# Altium schematic sheet [5]-Motor Driver_DRV8701.SchDoc
size A4
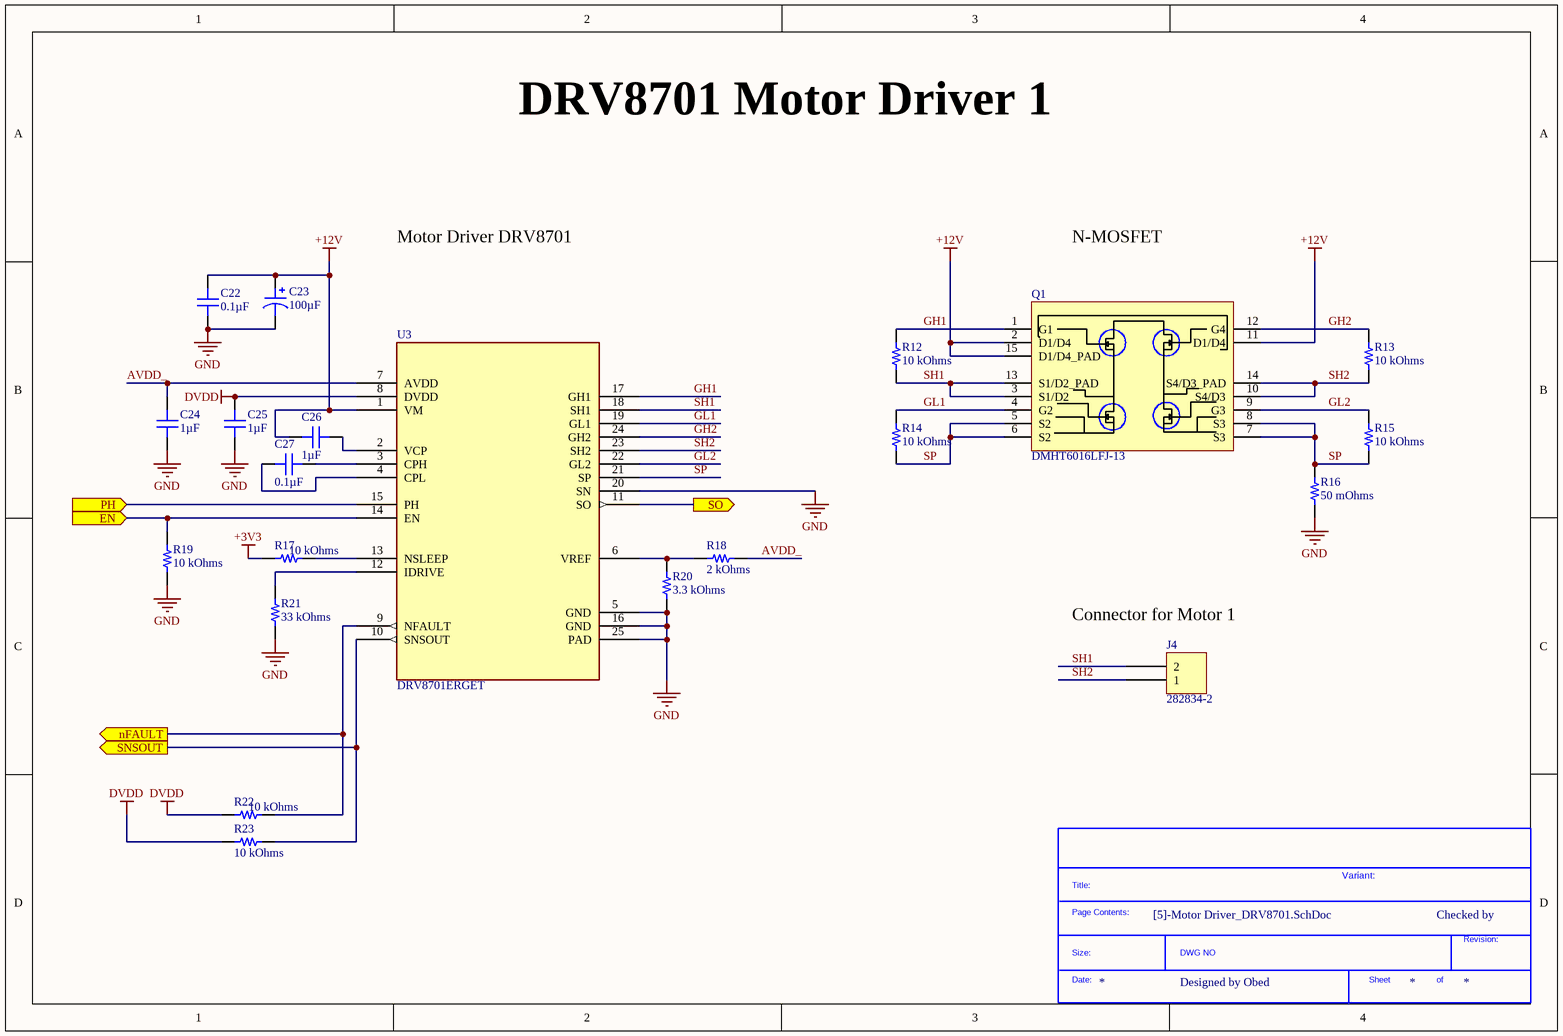
[diagram p0: [5]-Motor Driver_DRV8701.SchDoc]

## Parts
*?  SDTitleBlock  (value not drawn)  (graphical)
C22  0.1µF  [CAP 0805_2012]
C23  100µF  [CAP ALSMD 8.3MM H10.5MM]
C24  1µF  [CAP 0805_2012]
C25  1µF  [CAP 0805_2012]
C26  1µF  [CAP 0805_2012]
C27  0.1µF  [CAP 0805_2012]
J4  282834-2  [TE 282834-2]
Q1  DMHT6016LFJ-13  [DFN5045-12_33_212_27X15_SMD_1]
R12  10 kOhms  [RES 0805_2012]
R13  10 kOhms  [RES 0805_2012]
R14  10 kOhms  [RES 0805_2012]
R15  10 kOhms  [RES 0805_2012]
R16  50 mOhms  [RES 2512_6432]
R17  10 kOhms  [RES 0805_2012]
R18  2 kOhms  [RES 0603_1608]
R19  10 kOhms  [RES 0805_2012]
R20  3.3 kOhms  [RES 0603_1608]
R21  33 kOhms  [RES 0805_2012]
R22  10 kOhms  [RES 0805_2012]
R23  10 kOhms  [RES 0805_2012]
U3  DRV8701ERGET  [QFN50P400X400X100-25N]

## Ports
EN (in), nFAULT (out), PH (in), SNSOUT (out), SO (out)

## Nets
+3V3: R17.2
+12V: C22.1 C23.1 C26.2 Q1.2(D1/D4) Q1.11(D1/D4) Q1.15(D1/D4_PAD) U3.1(VM)
DVDD: C25.2 R22.2 R23.2 U3.8(DVDD)
GND: C22.2 C23.2 C24.1 C25.1 R16.1 R19.2 R20.1 R21.1 U3.5(GND) U3.16(GND) U3.20(SN) U3.25(PAD)
AVDD_: C24.2 R18.1 U3.7(AVDD)
EN: R19.1 U3.14(EN) ; port EN
GH1: Q1.1(G1) R12.2 U3.17(GH1)
GH2: Q1.12(G4) R13.2 U3.24(GH2)
GL1: Q1.4(G2) R14.2 U3.19(GL1)
GL2: Q1.9(G3) R15.2 U3.22(GL2)
nFAULT: R22.1 U3.9(NFAULT) ; port nFAULT
PH: U3.15(PH) ; port PH
SH1: J4.2 Q1.3(S1/D2) Q1.13(S1/D2_PAD) R12.1 U3.18(SH1)
SH2: J4.1 Q1.10(S4/D3) Q1.14(S4/D3_PAD) R13.1 U3.23(SH2)
SNSOUT: R23.1 U3.10(SNSOUT) ; port SNSOUT
SO: U3.11(SO) ; port SO
SP: Q1.5(S2) Q1.6(S2) Q1.7(S3) Q1.8(S3) R14.1 R15.1 R16.2 U3.21(SP)
NetC26_1: C26.1 U3.2(VCP)
NetC27_1: C27.1 U3.3(CPH)
NetC27_2: C27.2 U3.4(CPL)
NetR17_1: R17.1 U3.13(NSLEEP)
NetR18_2: R18.2 R20.2 U3.6(VREF)
NetR21_2: R21.2 U3.12(IDRIVE)

## Notes on the sheet
- DRV8701 Motor Driver 1
- Motor Driver DRV8701
- N-MOSFET
- (near J4) Connector for Motor 1
- Variant:
- Checked by
- Designed by Obed
- (in symbol SDTitleBlock) Title:; Page Contents:; Revision:; Size:; DWG NO; Date:; Sheet; of

## Library data of the parts
C22 C27 = 0805J0500104KXT: CAP CER 0.1UF 50V X7R 0805; Manufacturer: Knowles Syfer; Tolerance: ±10%; Part Number: 0805J0500104KXT; Value: 0.1µF; Applications: General Purpose; Capacitance: 0.1µF; ComponentLink1Description: Datasheet; ComponentLink1URL: https://www.knowlescapacitors.com/getattachment/2dbfc8bc-e2b3-4b4d-afb1-43b011b9ebe0/High-Std-Voltage.aspx; ComponentLink2Description: DigiKey Link; ComponentLink2URL: http://digikey.com/product-detail/en/knowles-syfer/0805J0500104KXT/1608-1000-1-ND/5730199; Device Package: 0805 (2012 Metric); LastUpdated: 02/09/2020 01:04:31; Lifecycle Status: Active; Minimum Order: 1; Mounting Type: Surface Mount, MLCC; Operating Temperature: -55°C ~ 125°C; Package / Case: 0805 (2012 Metric); Packaging: TapeAndReel; PartId: 8322; Part Status: Active; Price: 0.17; Series: -; Size / Dimension: 0.079" L x 0.049" W (2.00mm x 1.25mm); Supplier 1: DigiKey; Supplier Part Number 1: 1608-1000-1-ND; Temperature Coefficient: X7R; Thickness (Max): 0.051" (1.30mm); Voltage - Rated: 50V
C23 = EDT107M025A9MAA: CAP ALUM SMD 125C 100UF 25VDC; Manufacturer: KEMET; Lifetime @ Temp.: 2000 Hrs @ 125°C; Polarization: Polar; Ripple Current @ High Frequency: 156mA @ 10kHz; Ripple Current @ Low Frequency: 130mA @ 120Hz; Surface Mount Land Size: 0.327" L x 0.327" W (8.30mm x 8.30mm); Tolerance: ±20%; Voltage - Rated: 25V; Part Number: EDT107M025A9MAA; Applications: General Purpose; Capacitance: 100µF; ComponentLink1Description: Datasheet; ComponentLink1URL: https://api.kemet.com/component-edge/download/datasheet/EDT107M025A9MAA.pdf; ComponentLink2Description: DigiKey Link; ComponentLink2URL: http://digikey.com/product-detail/en/kemet/EDT107M025A9MAA/399-18156-1-ND/9354357; Device Package: Radial, Can - SMD; Height - Seated (Max): 0.413" (10.50mm); LastUpdated: 02/09/2020 01:25:14; Lifecycle Status: Active; Minimum Order: 1; Mounting Type: Surface Mount; Operating Temperature: -40°C ~ 125°C; Package / Case: Radial, Can - SMD; Packaging: TapeAndReel; PartId: 7637; Part Status: Active; Price: 0.23; Series: EDT; Size / Dimension: 0.315" Dia (8.00mm); Supplier 1: DigiKey; Supplier Part Number 1: 399-18156-1-ND; Value: 100µF
C24-C26 = 08055C105K4T2A: CAP CER 1UF 50V X7R 0805; Manufacturer: AVX Corporation; Tolerance: ±10%; Part Number: 08055C105K4T2A; Value: 1µF; Applications: Automotive; Capacitance: 1µF; ComponentLink1Description: Datasheet; ComponentLink1URL: http://datasheets.avx.com/AutoMLCC.pdf; ComponentLink2Description: DigiKey Link; ComponentLink2URL: http://digikey.com/product-detail/en/avx-corporation/08055C105K4T2A/478-9556-1-ND/5322894; Device Package: 0805 (2012 Metric); LastUpdated: 02/09/2020 01:04:35; Lifecycle Status: Active; Minimum Order: 1; Mounting Type: Surface Mount, MLCC; Operating Temperature: -55°C ~ 125°C; Package / Case: 0805 (2012 Metric); Packaging: TapeAndReel; PartId: 6460; Part Status: Active; Price: 0.08; Ratings: AEC-Q200; Series: -; Size / Dimension: 0.079" L x 0.049" W (2.00mm x 1.25mm); Supplier 1: DigiKey; Supplier Part Number 1: 478-9556-1-ND; Temperature Coefficient: X7R; Thickness (Max): 0.055" (1.40mm); Voltage - Rated: 50V
J4 = 282834-2: TERM BLK 2P SIDE ENT 2.54MM PCB; Manufacturer: TE Connectivity AMP Connectors; Current: 10A; Mating Orientation: Horizontal with Board; Number of Levels: 1; Pitch: 0.100" (2.54mm); Positions Per Level: 2; Voltage: 150V; Wire Gauge: 16-30 AWG; Wire Termination: Screw - Rising Cage Clamp; Part Number: 282834-2; Color: Green; ComponentLink1Description: Datasheet; ComponentLink1URL: https://www.te.com/commerce/DocumentDelivery/DDEController?Action=srchrtrv&DocNm=282834&DocType=Customer+Drawing&DocLang=English; ComponentLink2Description: DigiKey Link; ComponentLink2URL: http://digikey.com/product-detail/en/te-connectivity-amp-connectors/282834-2/A98333-ND/1150135; LastUpdated: 15/01/2020 04:15:38; Lifecycle Status: Active; Minimum Order: 1; Mounting Type: Through Hole; Packaging: Bulk; Part Status: Active; Price: 0.88; Series: Buchanan; Supplier 1: DigiKey; Supplier Part Number 1: A98333-ND
Q1 = MOSFET-N_60V-14.8A-V-DFN5045-12: Mosfet Array 4 N-Channel 14.8A (Ta) Surface Mount V-DFN5045-12; Manufacturer: Diodes; Supplier 1: Digi-Key; Manufacturer Part Number: DMHT6016LFJ-13; Category: MOSFETs; Pricing 1: 1=1.65000, 10=1.48400, 25=1.40040, 100=1.19310, 500=0.98020, 1000=0.81217 (USD); Mount: Surface Mount; Packaging: Tape and Reel; ComponentLink1URL: https://www.diodes.com/assets/Datasheets/DMHT6016LFJ.pdf?src-supplier=Digi-Key; ComponentLink1Description: https://www.diodes.com/assets/Datasheets/DMHT6016LFJ.pdf?src-supplier=Digi-Key; Supplier Part Number 1: DMHT6016LFJ-13DICT-ND
R12-R15 R17 R19 R22 R23 = CRCW080510K0FKEA: RES SMD 10K OHM 1% 1/8W 0805; Manufacturer: Vishay Dale; Power (Watts): 0.125W, 1/8W; Temperature Coefficient: ±100ppm/°C; Part Number: CRCW080510K0FKEA; Value: 10 kOhms; ComponentLink1Description: Datasheet; ComponentLink1URL: http://www.vishay.com/docs/20035/dcrcwe3.pdf; ComponentLink2Description: DigiKey Link; ComponentLink2URL: http://digikey.com/product-detail/en/vishay-dale/CRCW080510K0FKEA/541-10.0KCCT-ND/1180897; Composition: Thick Film; Device Package: 0805 (2012 Metric); Features: Automotive AEC-Q200; Height - Seated (Max): 0.020" (0.50mm); LastUpdated: 02/09/2020 01:15:23; Lifecycle Status: Active; Minimum Order: 1; Number of Terminations: 2; Operating Temperature: -55°C ~ 155°C; Package / Case: 0805 (2012 Metric); Packaging: TapeAndReel; PartId: 28101; Part Status: Active; Price: 0.01; Ratings: AEC-Q200; Resistance: 10 kOhms; Series: CRCW; Size / Dimension: 0.079" L x 0.049" W (2.00mm x 1.25mm); Supplier 1: DigiKey; Supplier Part Number 1: 541-10.0KCCT-ND; Supplier Device Package: 0805; Tolerance: ±1%
R16 = PA2512FKF7W0R05E: METAL CURRENT SENSOR 2512 1% 100; Manufacturer: Yageo; Power (Watts): 2W; Temperature Coefficient: ±100ppm/°C; Part Number: PA2512FKF7W0R05E; ComponentLink1Description: Datasheet; ComponentLink1URL: http://www.yageo.com/documents/recent/PYu-PA_E_51_RoHS_10.pdf; ComponentLink2Description: DigiKey Link; ComponentLink2URL: http://digikey.com/product-detail/en/yageo/PA2512FKF7W0R05E/YAG6100CT-ND/9696554; Composition: Metal Element; Device Package: 2512 (6432 Metric); Features: Automotive AEC-Q200, Current Sense, Moisture Resistant; Height - Seated (Max): 0.035" (0.88mm); LastUpdated: 02/09/2020 01:26:58; Lifecycle Status: Active; Minimum Order: 1; Number of Terminations: 2; Operating Temperature: -55°C ~ 170°C; Package / Case: 2512 (6432 Metric); Packaging: TapeAndReel; Part Status: Active; Price: 0.20; Ratings: AEC-Q200; Resistance: 50 mOhms; Series: PA_E; Size / Dimension: 0.250" L x 0.125" W (6.35mm x 3.18mm); Supplier 1: DigiKey; Supplier Part Number 1: YAG6100CT-ND; Supplier Device Package: 2512; Tolerance: ±1%; Value: 50 mOhms
R18 = RMCF0603FT2K00: RES 2K OHM 1% 1/10W 0603; Manufacturer: Stackpole Electronics Inc; Power (Watts): 0.1W, 1/10W; Temperature Coefficient: ±100ppm/°C; Part Number: RMCF0603FT2K00; Value: 2 kOhms; ComponentLink1Description: Datasheet; ComponentLink1URL: https://www.seielect.com/catalog/sei-rmcf_rmcp.pdf; ComponentLink2Description: DigiKey Link; ComponentLink2URL: http://digikey.com/product-detail/en/stackpole-electronics-inc/RMCF0603FT2K00/RMCF0603FT2K00CT-ND/1943009; Composition: Thick Film; Device Package: 0603 (1608 Metric); Features: Automotive AEC-Q200; Height - Seated (Max): 0.022" (0.55mm); LastUpdated: 02/09/2020 01:10:22; Lifecycle Status: Active; Minimum Order: 1; Number of Terminations: 2; Operating Temperature: -55°C ~ 155°C; Package / Case: 0603 (1608 Metric); Packaging: CutTape; PartId: 6085; Part Status: Active; Price: 0.10; Ratings: AEC-Q200; Resistance: 2 kOhms; Series: RMCF; Size / Dimension: 0.061" L x 0.031" W (1.55mm x 0.80mm); Supplier 1: DigiKey; Supplier Part Number 1: RMCF0603FT2K00CT-ND; Supplier Device Package: 0603; Tolerance: ±1%
R20 = CRGP0603F3K3: CRGP 0603 3K3 1%; Manufacturer: TE Connectivity Passive Product; Power (Watts): 0.25W, 1/4W; Temperature Coefficient: ±100ppm/°C; Part Number: CRGP0603F3K3; Value: 3.3 kOhms; ComponentLink1Description: Datasheet; ComponentLink1URL: https://www.te.com/commerce/DocumentDelivery/DDEController?Action=srchrtrv&DocNm=9-1773463-9&DocType=DS&DocLang=English; ComponentLink2Description: DigiKey Link; ComponentLink2URL: http://digikey.com/product-detail/en/te-connectivity-passive-product/CRGP0603F3K3/A130422CT-ND/8578254; Composition: Thick Film; Device Package: 0603 (1608 Metric); Features: Pulse Withstanding; Height - Seated (Max): 0.022" (0.55mm); LastUpdated: 02/09/2020 01:10:24; Lifecycle Status: Active; Minimum Order: 1; Number of Terminations: 2; Operating Temperature: -55°C ~ 155°C; Package / Case: 0603 (1608 Metric); Packaging: TapeAndReel; PartId: 5037; Part Status: Active; Price: 0.02; Resistance: 3.3 kOhms; Series: CRGP; Size / Dimension: 0.063" L x 0.031" W (1.60mm x 0.80mm); Supplier 1: DigiKey; Supplier Part Number 1: A130422CT-ND; Supplier Device Package: 0603; Tolerance: ±1%
R21 = RMCF0805FT33K0: RES 33K OHM 1% 1/8W 0805; Manufacturer: Stackpole Electronics Inc; Power (Watts): 0.125W, 1/8W; Temperature Coefficient: ±100ppm/°C; Part Number: RMCF0805FT33K0; Value: 33 kOhms; ComponentLink1Description: Datasheet; ComponentLink1URL: https://www.seielect.com/catalog/sei-rmcf_rmcp.pdf; ComponentLink2Description: DigiKey Link; ComponentLink2URL: http://digikey.com/product-detail/en/stackpole-electronics-inc/RMCF0805FT33K0/RMCF0805FT33K0CT-ND/1942464; Composition: Thick Film; Device Package: 0805 (2012 Metric); Features: Automotive AEC-Q200; Height - Seated (Max): 0.026" (0.65mm); LastUpdated: 02/09/2020 01:15:14; Lifecycle Status: Active; Minimum Order: 1; Number of Terminations: 2; Operating Temperature: -55°C ~ 155°C; Package / Case: 0805 (2012 Metric); Packaging: CutTape; PartId: 32416; Part Status: Active; Price: 0.10; Ratings: AEC-Q200; Resistance: 33 kOhms; Series: RMCF; Size / Dimension: 0.079" L x 0.049" W (2.00mm x 1.25mm); Supplier 1: DigiKey; Supplier Part Number 1: RMCF0805FT33K0CT-ND; Supplier Device Package: 0805; Tolerance: ±1%
U3 = IC_DRV8701ERGET: IC MOTOR DRIVER 0V-5.5V 24VQFN; Manufacturer: Texas Instruments; Supplier 1: Digi-Key; Manufacturer Part Number: DRV8701ERGET; Category: Integrated Circuits (ICs); Pricing 1: 1=2.52000, 10=2.26100, 25=2.13320, 100=1.81750 (USD); Mount: Surface Mount; Case/Package: VQFN; ComponentLink1URL: http://www.ti.com/general/docs/lit/getliterature.tsp?genericPartNumber=DRV8701&&fileType=pdf&src-supplier=Avnet; ComponentLink1Description: http://www.ti.com/general/docs/lit/getliterature.tsp?genericPartNumber=DRV8701&&fileType=pdf&src-supplier=Avnet; ComponentLink2URL: http://www.ti.com/lit/ds/symlink/drv8701.pdf?src-supplier=Digi-Key; ComponentLink2Description: http://www.ti.com/lit/ds/symlink/drv8701.pdf?src-supplier=Digi-Key